# Altium project PIC.PrjPcb
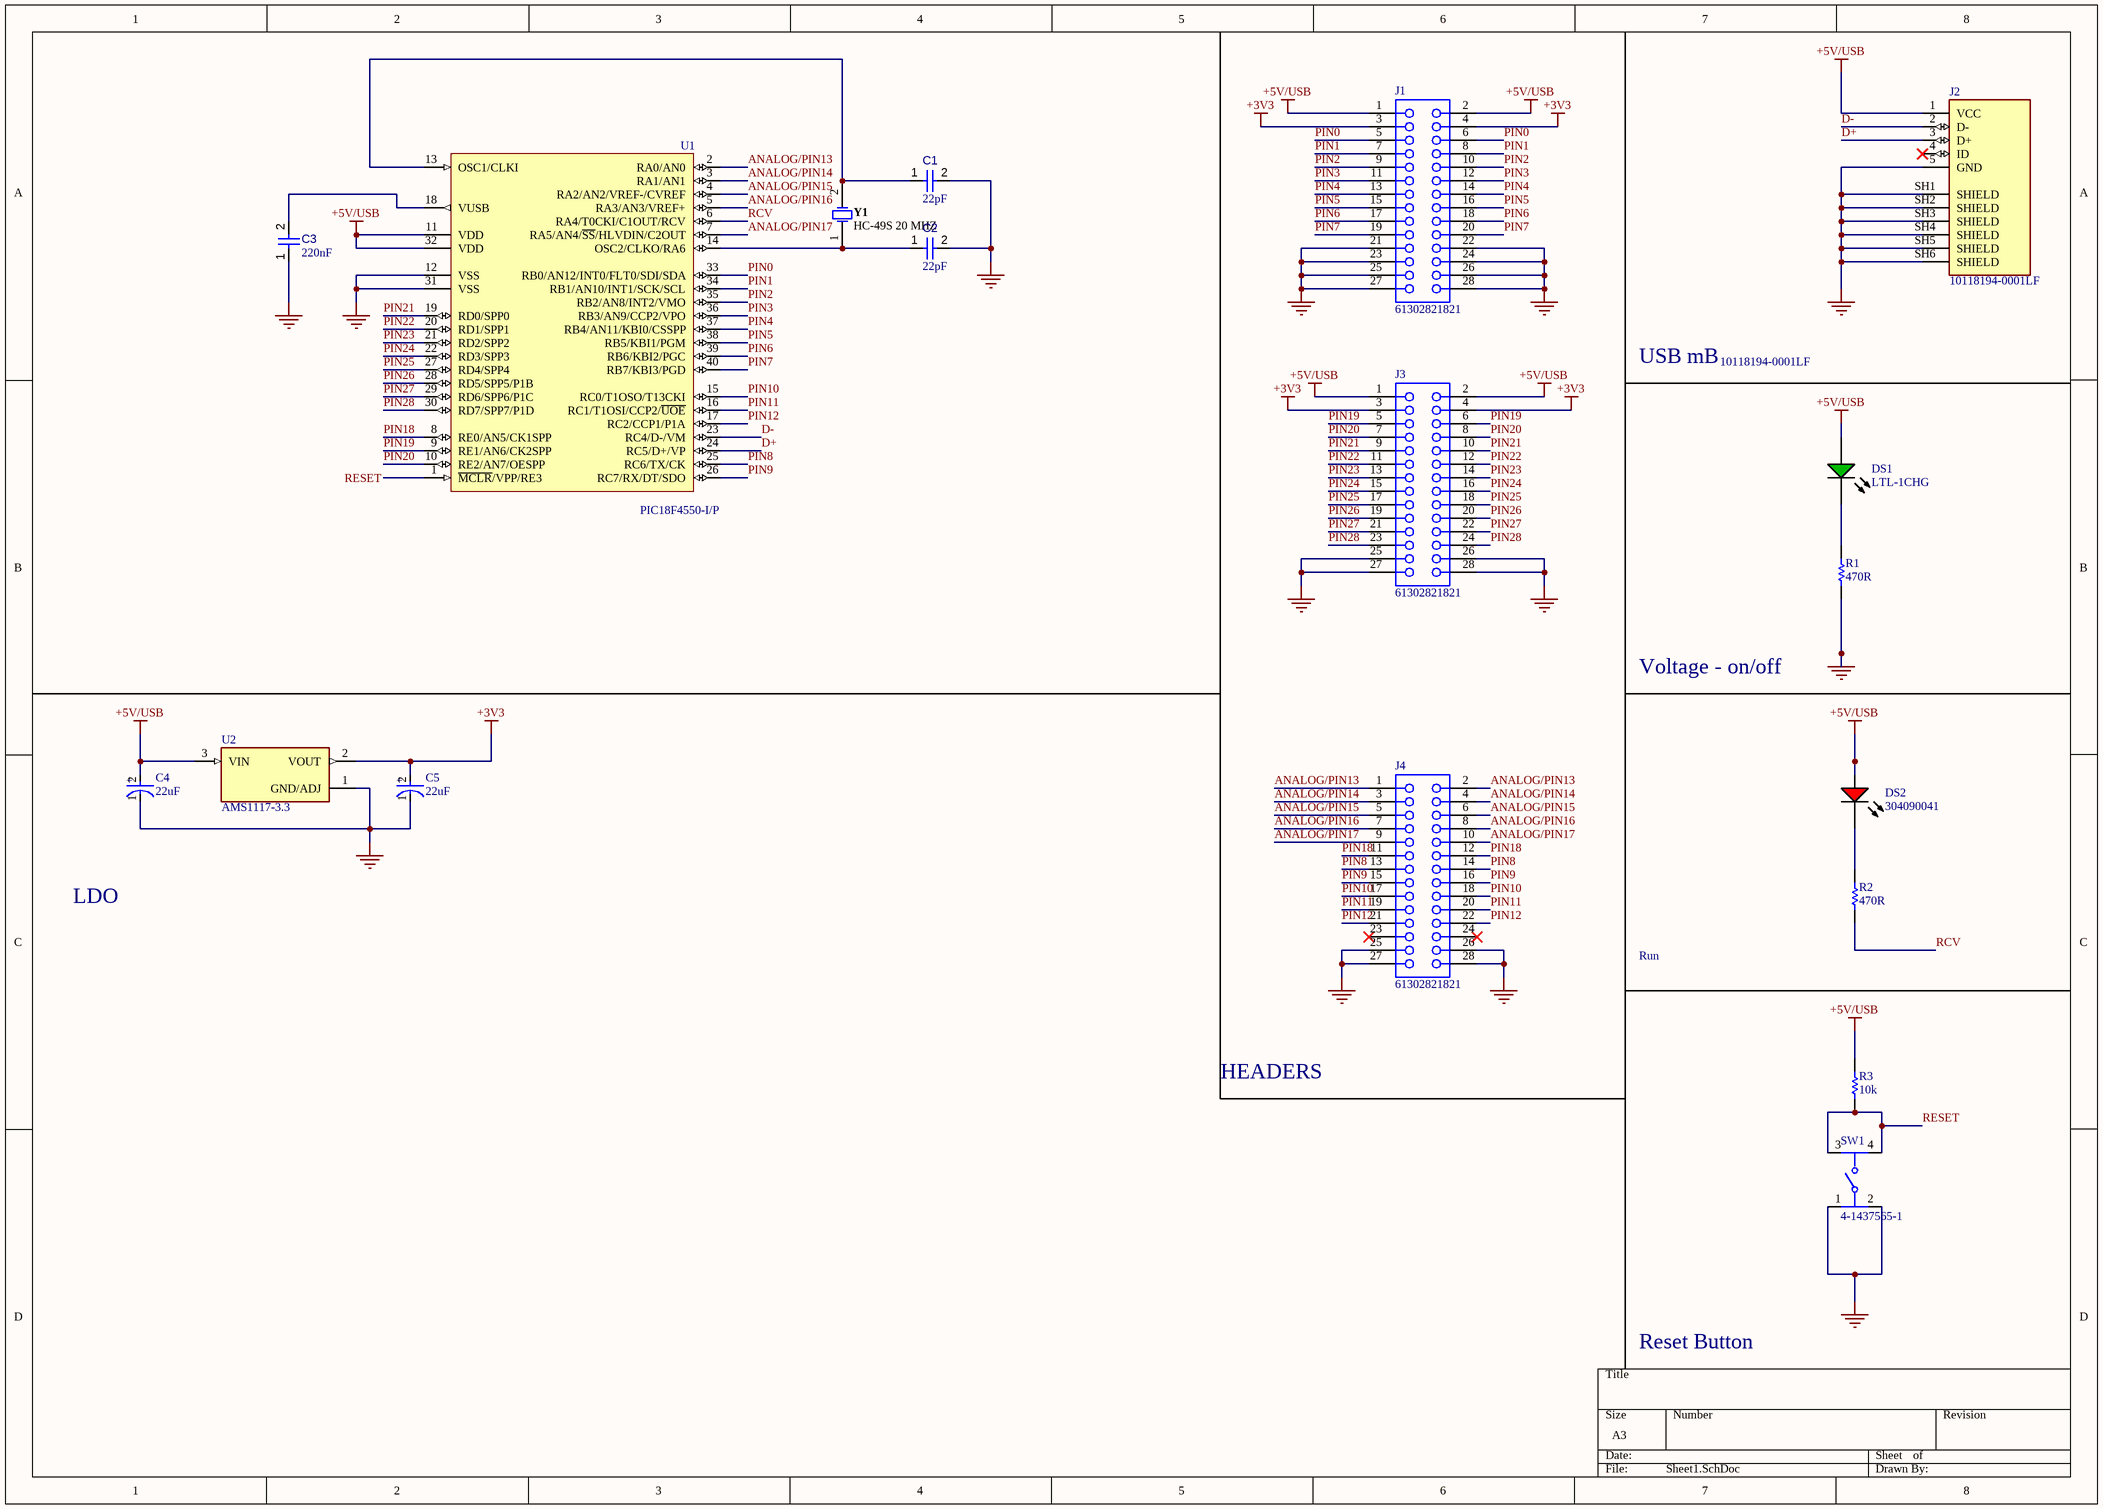
[diagram p0: Sheet1.SchDoc]
1 sheet, 18 parts. Net scope: global (net labels, ports and power ports of the same name join across sheets).
Board file: PCB1.PcbDoc

## Sheet Sheet1.SchDoc
size A3; SheetNumber: 1; SheetTotal: 1

### Parts
C1  value 22pF  [CAPC0805(2012)145_L]  (hidden comment: Capacitor 47µF +/-40% 6.3V 0805)
C2  value 22pF  [CAPC0805(2012)145_L]  (hidden comment: Capacitor 47µF +/-40% 6.3V 0805)
C3  value 220nF  [CAPC0805(2012)145_L]  (hidden comment: Capacitor 47µF +/-40% 6.3V 0805)
C4  22uF  [FP-TAJA-MFG]
C5  22uF  [FP-TAJA-MFG]
DS1  LTL-1CHG  [LTST-LTL-1CHG-2]
DS2  304090041  [LED-2P-2.28-3MM_A]
J1  61302821821  [61302821821]
J2  10118194-0001LF  [AMPHENOL_10118194-0001LF]
J3  61302821821  [61302821821]
J4  61302821821  [61302821821]
R1  470R  [RESC3216X70X50LL05T20]
R2  470R  [RESC3216X70X50LL05T20]
R3  10k  [RESC3216X70X50LL05T20]
SW1  4-1437565-1  [FP-4-1437565-1-MFG]
U1  PIC18F4550-I/P  [PDIP600-P40]
U2  AMS1117-3.3  [SOT229P700X180-4N]
Y1  HC-49S 20 MHZ  [JPY-HC-49US]

### Nets
+3V3: C5.2(A) J1.3 J1.4 J3.3 J3.4 U2.2(VOUT)
+5V/USB: C4.2(A) DS1.1(A) DS2.1(A) J1.1 J1.2 J2.1(VCC) J3.1 J3.2 R3.2 U1.11(VDD) U1.32(VDD) U2.3(VIN)
GND: C1.2 C2.2 C3.1 C4.1(C) C5.1(C) J1.21 J1.22 J1.23 J1.24 J1.25 J1.26 J1.27 J1.28 J2.5(GND) J2.SH1(SHIELD) J2.SH2(SHIELD) J2.SH3(SHIELD) J2.SH4(SHIELD) J2.SH5(SHIELD) J2.SH6(SHIELD) J3.25 J3.26 J3.27 J3.28 J4.25 J4.26 J4.27 J4.28 R1.1 SW1.1 SW1.2 U1.12(VSS) U1.31(VSS) U2.1(GND/ADJ)
\: J3.7 J3.8 U1.10(RE2/AN7/OESPP)  [also labelled PIN20]
ANALOG/PIN13: J4.1 J4.2 U1.2(RA0/AN0)
ANALOG/PIN14: J4.3 J4.4 U1.3(RA1/AN1)
ANALOG/PIN15: J4.5 J4.6 U1.4(RA2/AN2/VREF-/CVREF)
ANALOG/PIN16: J4.7 J4.8 U1.5(RA3/AN3/VREF+)
ANALOG/PIN17: J4.9 J4.10 U1.7(RA5/AN4/~{SS}/HLVDIN/C2OUT)
D+: J2.3(D+) U1.24(RC5/D+/VP)
D-: J2.2(D-) U1.23(RC4/D-/VM)
PIN0: J1.5 J1.6 U1.33(RB0/AN12/INT0/FLT0/SDI/SDA)
PIN1: J1.7 J1.8 U1.34(RB1/AN10/INT1/SCK/SCL)
PIN2: J1.9 J1.10 U1.35(RB2/AN8/INT2/VMO)
PIN3: J1.11 J1.12 U1.36(RB3/AN9/CCP2/VPO)
PIN4: J1.13 J1.14 U1.37(RB4/AN11/KBI0/CSSPP)
PIN5: J1.15 J1.16 U1.38(RB5/KBI1/PGM)
PIN6: J1.17 J1.18 U1.39(RB6/KBI2/PGC)
PIN7: J1.19 J1.20 U1.40(RB7/KBI3/PGD)
PIN8: J4.13 J4.14 U1.25(RC6/TX/CK)
PIN9: J4.15 J4.16 U1.26(RC7/RX/DT/SDO)
PIN10: J4.17 J4.18 U1.15(RC0/T1OSO/T13CKI)
PIN11: J4.19 J4.20 U1.16(RC1/T1OSI/CCP2/~{UOE})
PIN12: J4.21 J4.22 U1.17(RC2/CCP1/P1A)
PIN18: J4.11 J4.12 U1.8(RE0/AN5/CK1SPP)
PIN19: J3.5 J3.6 U1.9(RE1/AN6/CK2SPP)
PIN21: J3.9 J3.10 U1.19(RD0/SPP0)
PIN22: J3.11 J3.12 U1.20(RD1/SPP1)
PIN23: J3.13 J3.14 U1.21(RD2/SPP2)
PIN24: J3.15 J3.16 U1.22(RD3/SPP3)
PIN25: J3.17 J3.18 U1.27(RD4/SPP4)
PIN26: J3.19 J3.20 U1.28(RD5/SPP5/P1B)
PIN27: J3.21 J3.22 U1.29(RD6/SPP6/P1C)
PIN28: J3.23 J3.24 U1.30(RD7/SPP7/P1D)
RCV: R2.1 U1.6(RA4/T0CKI/C1OUT/RCV)
RESET: R3.1 SW1.3 SW1.4 U1.1(~{MCLR}/VPP/RE3)
NetC1_1: C1.1 U1.13(OSC1/CLKI) Y1.2
NetC2_1: C2.1 U1.14(OSC2/CLKO/RA6) Y1.1
NetC3_2: C3.2 U1.18(VUSB)
NetDS1_2: DS1.2(K) R1.2
NetDS2_2: DS2.2(K) R2.2

Not connected (* = marked no-connect by the designer): J2 4(ID)*; J4 23* 24*

### Notes on the sheet
- USB mB
- 10118194-0001LF
- Voltage - on/off
- LDO
- Run
- HEADERS
- Reset Button
- (in symbol CMP-2000-07524-2) +

### Library data of the parts
C1-C3 = CMP-001-00082-4: Chip Capacitor 0805; Tolerance: 10%; Min Operating Temperature: -55°C; Max Operating Temperature: 85°C; Case/Package: 0805; Pins: 2; Mounting Technology: SMT; Voltage Rating: 6.3V
C4 C5 = CMP-2000-07524-2: 22uF 10V  ±10% 3Ω 1206  SMD Tantalum Capacitor; ESR (Equivalent Series Resistance): 3R; Leakage Current: 2.2uA; Polarity: Polar; Dissipation Factor: 8%; Termination: SMD/SMT; Voltage Rating (DC): 10V; Capacitance: 22uF; Number of Pins: 2; Length: 3.2mm; Min Operating Temperature: -55°C; Lead Free: Lead Free; Lead Pitch: 1.1mm; Case Code (Metric): 3216; Width: 1.6mm; Tolerance: 10%; Depth: 1.6mm; Max Operating Temperature: 125°C; Construction: Flat; Height: 1.6mm; Voltage: 10V; Packaging: Tape and Reel; Height - Seated (Max): 0.071inch; Mount: Surface Mount; Voltage Rating: 10V; RoHS Compliant: Yes; Case Code (Imperial): 1206; Features: General Purpose; REACH SVHC: No SVHC; Package Quantity: 1; Radiation Hardening: No; Series: TAJ; Dielectric Material: Tantalum; Case/Package: 1206
DS1 = CMP-007-00019-2: LED Uni-Color Green, 100 mW, 30 mA, -55 to 100 degC, 2-Pin THD, RoHS, Bulk; Manufacturer: Lite-On; Power: 100mW; Forward Voltage: 2.6V; Forward Current: 30mA; Nominal Vf: 2.1V; Lens Style: Dome; Viewing Angle: 60degrees; Luminous Intensity: 12.6mcd; Max Operating Temperature: 100°C; Case/Package: Radial; Package Reference: LTL-1CHG; Manufacturer URL: http://www.us.liteon.com/; Package Quantity: 1000; Colour: Green; Packaging: Bulk; RoHS Compliant: True; Datasheet URL: http://datasheet.octopart.com/LTL-1CHG-Lite-On-datasheet-143841.pdf; Package Description: 2-Pin Through Hole Device, Dia 3.8 mm; Min Operating Temperature: -55°C; Mounting Technology: TH; Pins: 2; Illumination Colour: Green; Datasheet Version: Mar-00
DS2 = CMP-007-00007-2: Red LED, 80 mW, 30 mA, -25 to 85 degC, 2-Pin THD; Manufacturer: Shenzhen CGX; Package Description: 2-Pin Through Hole Device, Dia 3 mm, Pitch 2.28 mm; Datasheet URL: http://datasheet.octopart.com/304090041-Chengguangxing-datasheet-62330656.pdf; Mounting Technology: TH; Manufacturer URL: http://szcgx.com/; RoHS Compliant: Unknown; Datasheet Version: Sep-14; Case/Package: 304090041; Package Reference: 304090041
J1 J3 J4 = CMP-1502-01360-3: NexarPartId: 61924758; Operating Supply Voltage: 250V; Current Rating: 3A; Contact Resistance: 20mΩ; Gender: Female; Lead Pitch: 2.54mm; RoHS: Non-Compliant; Number of Pins: 28; Orientation: Vertical
J2 = 10118194-0001LF: Micro USB, Input Output Connectors, B TYPE RECEPTACLE with flange; MF: Amphenol ICC; SnapEDA_Link: https://www.snapeda.com/parts/10118194-0001LF/Amphenol+FCI/view-part/?ref=snap; Package: None; Value: *; MP: 10118194-0001LF; Check_prices: https://www.snapeda.com/parts/10118194-0001LF/Amphenol+FCI/view-part/?ref=eda
R1-R3 = CMP-2003-00388-1: Manufacturer: Panasonic; Part Number: ERJ8ENF4700V
SW1 = CMP-03407-000003-1: SWITCH TACTILE SPST-NO 0.05A 24V; Manufacturer: TE Connectivity; Ciiva Ids: 2672442; Contact Current Rating: 50mA; Operating Force: 160gf; Contact Resistance: 100mΩ; Electromechanical Life: 100000Cycles; Standoff Height: 0.05mm; Import Ts: 1521848451; Category: Switch; ComponentLink2Description: Datasheet; Mount: Surface Mount; Digikey Description: SWITCH TACTILE SPST-NO 0.05A 24V; Device Class L3: Tactile Switches; Release Date: 1503379960; Octopart: https://octopart.com/fsm4jsma-te+connectivity-55488004; Temperature Range Low: -35°C; Lead Free: Yes; RoHS: TRUE; Mouser Description: Switch Tactile OFF (ON) SPST Round Button Gull Wing 0.05A 12VDC 1.57N SMD Loose Piece; Voltage Rating Dc: 24V; ComponentLink2URL: https://www.te.com/commerce/DocumentDelivery/DDEController?Action=showdoc&DocId=Customer+Drawing%7F2-1437565-7%7FV%7Fpdf%7FEnglish%7FENG_CD_2-1437565-7_V.pdf%7F4-1437565-1; Height: 5.38mm; Package: 0; Temperature Range High: +85°C; Device Class L2: Switches; Manufacturer Part Number: 4-1437565-1; Temperature: -35°C to +85°C; Device Class L1: Electromechanical; Automotive: No; Throw Configuration: SPST-NO
U1 = CMP-0116-00114-1: High Performance, Enhanced Flash, USB Microcontroller with nanoWatt Technology, 32K Flash, 40-Pin PDIP, Industrial Temperature Range; PackageDescription: 40-Lead Plastic Dual In-Line (P) - 600 mil Body [PDIP]; PackageReference: PDIP600-P40; DatasheetVersion: revE, Aug-2008; PackageVersion: revBB, Aug-2009
U2 = AMS1117-3.3: Sot223/Pkg 1-Amp 3.3-Volt Low Drop Out Voltage Regulatator; MF: Advanced Monolithic Systems; SnapEDA_Link: https://www.snapeda.com/parts/AMS1117-3.3/Advanced+Monolithic+Systems/view-part/?ref=snap; Package: SOT-223 Seeed Technology; Value: *; MP: AMS1117-3.3; Check_prices: https://www.snapeda.com/parts/AMS1117-3.3/Advanced+Monolithic+Systems/view-part/?ref=eda
Y1 = CMP-003-00005-2: Crystal, 16 MHz, +/- 30 ppm, 18 pF, -20 to 70 degC, 2-Pin THD; Manufacturer: Jing peng yuan; Frequency: 16MHz; Package Reference: HC-49US; Case/Package: HC-49US; RoHS Compliant: Unknown; Mounting Technology: TH; Package Description: 2-Pin Throug Hole Device, Body 11.05 x 4.65 mm, Pitch 4.9 mm; Datasheet URL: https://statics3.seeedstudio.com/images/opl/datasheet/306010014.pdf; Datasheet Version: May-15